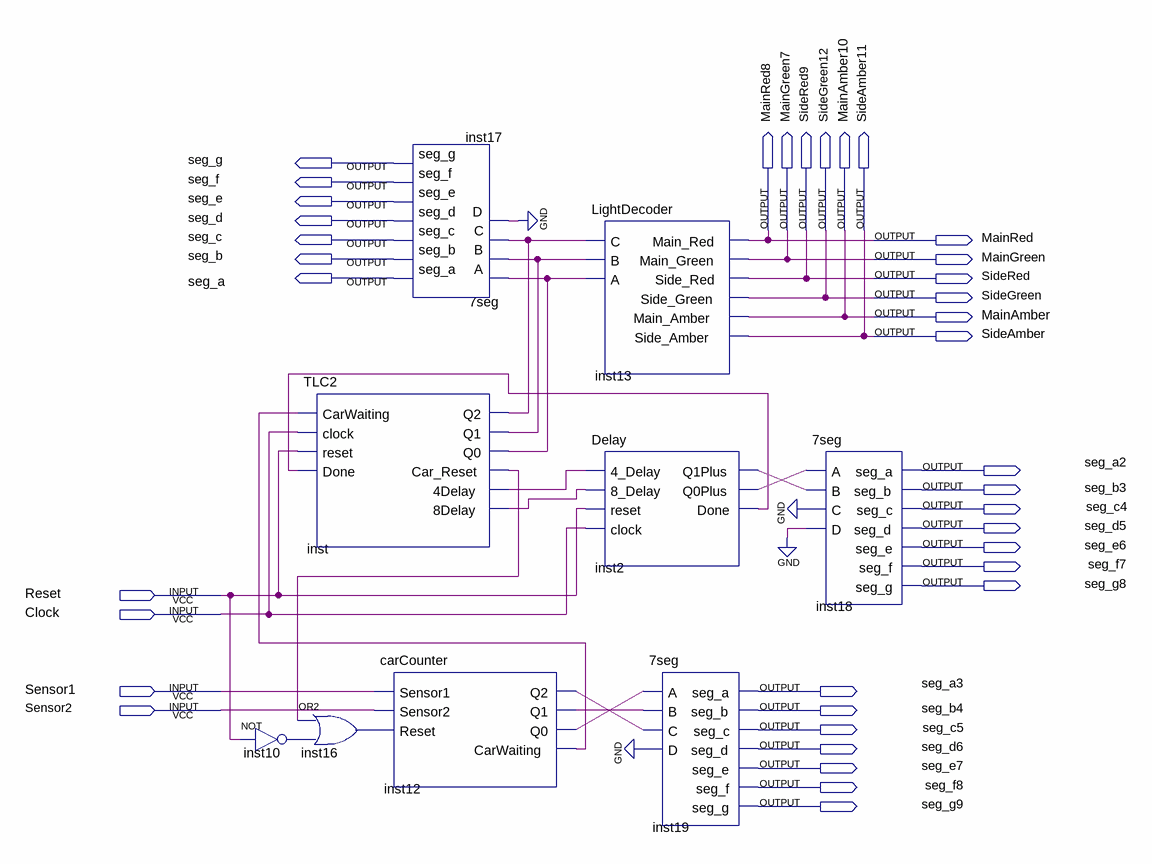
[diagram p0: schematic sheet]
// Quartus schematic All2.bdf as structural Verilog: 9 symbols, 37 pins
module All2 (
  input  Reset,
  input  Clock,
  input  Sensor1,
  input  Sensor2,
  output seg_g,
  output seg_f,
  output seg_e,
  output seg_d,
  output MainRed8,
  output MainGreen7,
  output SideRed9,
  output SideGreen12,
  output MainAmber10,
  output SideAmber11,
  output seg_c,
  output MainRed,
  output seg_b,
  output MainGreen,
  output seg_a,
  output SideRed,
  output SideGreen,
  output MainAmber,
  output SideAmber,
  output seg_a2,
  output seg_b3,
  output seg_c4,
  output seg_d5,
  output seg_e6,
  output seg_f7,
  output seg_g8,
  output seg_a3,
  output seg_b4,
  output seg_c5,
  output seg_d6,
  output seg_e7,
  output seg_f8,
  output seg_g9
);

  wire inst2_done, inst2_q0plus, inst2_q1plus, inst10_out, inst12_carwaiting, inst12_q0, inst12_q1,
       inst12_q2, inst16_out, inst_4delay, inst_8delay, inst_car_reset, inst_q0, inst_q1, inst_q2;

  not inst10 (inst10_out, Reset);
  TLC2 inst (
    .CarWaiting(inst12_carwaiting), .clock(Clock), .reset(Reset), .Done(inst2_done), .Q2(inst_q2),
    .Q1(inst_q1), .Q0(inst_q0), .Car_Reset(inst_car_reset), .\4Delay (inst_4delay), .\8Delay (inst_8delay));
  or inst16 (inst16_out, inst_car_reset, inst10_out);
  \7seg  inst17 (
    .A(inst_q0), .B(inst_q1), .C(inst_q2), .D(1'b0), .seg_a(seg_a), .seg_b(seg_b), .seg_c(seg_c),
    .seg_d(seg_d), .seg_e(seg_e), .seg_f(seg_f), .seg_g(seg_g));
  carCounter inst12 (
    .Sensor1(Sensor1), .Sensor2(Sensor2), .Reset(inst16_out), .Q2(inst12_q2), .Q1(inst12_q1), .Q0(inst12_q0),
    .CarWaiting(inst12_carwaiting));
  LightDecoder inst13 (
    .C(inst_q2), .B(inst_q1), .A(inst_q0), .Main_Red(MainRed), .Main_Green(MainGreen), .Side_Red(SideRed),
    .Side_Green(SideGreen), .Main_Amber(MainAmber), .Side_Amber(SideAmber));
  Delay inst2 (
    .\4_Delay (inst_4delay), .\8_Delay (inst_8delay), .reset(Reset), .clock(Clock), .Q1Plus(inst2_q1plus),
    .Q0Plus(inst2_q0plus), .Done(inst2_done));
  \7seg  inst19 (
    .A(inst12_q0), .B(inst12_q1), .C(inst12_q2), .D(1'b0), .seg_a(seg_a3), .seg_b(seg_b4), .seg_c(seg_c5),
    .seg_d(seg_d6), .seg_e(seg_e7), .seg_f(seg_f8), .seg_g(seg_g9));
  \7seg  inst18 (
    .A(inst2_q0plus), .B(inst2_q1plus), .C(1'b0), .D(1'b0), .seg_a(seg_a2), .seg_b(seg_b3), .seg_c(seg_c4),
    .seg_d(seg_d5), .seg_e(seg_e6), .seg_f(seg_f7), .seg_g(seg_g8));

  assign MainAmber10 = MainAmber;
  assign MainGreen7 = MainGreen;
  assign MainRed8 = MainRed;
  assign SideAmber11 = SideAmber;
  assign SideGreen12 = SideGreen;
  assign SideRed9 = SideRed;
endmodule
